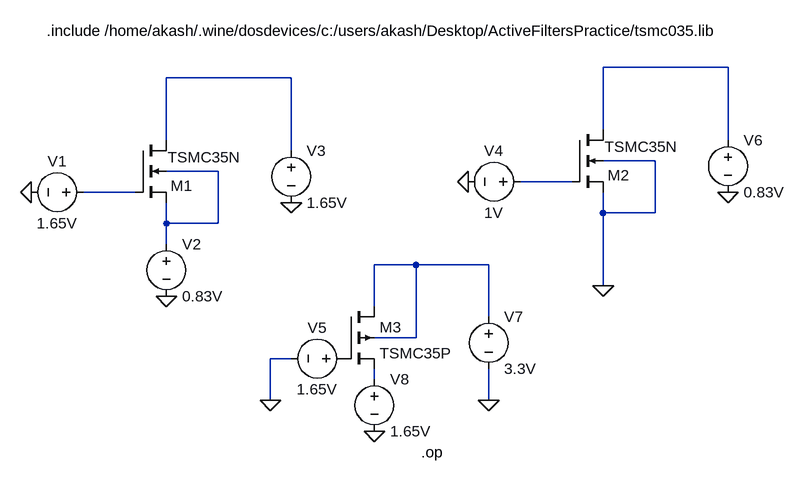
[diagram p0: schematic Transconductor_Bias_Width_Calculation.asc]
Transconductor_Bias_Width_Calculation.asc, the LTspice schematic file:
Version 4
SHEET 1 880 688
WIRE 736 80 544 80
WIRE 64 96 -128 96
WIRE 544 176 544 80
WIRE -128 192 -128 96
WIRE 736 192 736 80
WIRE 64 208 64 96
WIRE 624 224 544 224
WIRE -48 240 -128 240
WIRE 496 256 416 256
WIRE -176 272 -256 272
WIRE 544 304 544 272
WIRE 624 304 624 224
WIRE 624 304 544 304
WIRE -128 320 -128 288
WIRE -48 320 -48 240
WIRE -48 320 -128 320
WIRE -128 352 -128 320
WIRE 256 384 192 384
WIRE 368 384 256 384
WIRE 544 416 544 304
WIRE 192 448 192 384
WIRE 368 464 368 384
WIRE 256 496 256 384
WIRE 256 496 192 496
WIRE 64 528 32 528
WIRE 192 560 192 544
WIRE 32 592 32 528
WIRE 368 592 368 544
FLAG -336 272 0
FLAG -128 432 0
FLAG 64 288 0
FLAG 336 256 0
FLAG 544 416 0
FLAG 736 272 0
FLAG 368 592 0
FLAG 32 592 0
FLAG 192 640 0
SYMBOL nmos4 -176 192 R0
WINDOW 0 55 70 Left 2
WINDOW 3 50 26 Left 2
SYMATTR InstName M1
SYMATTR Value TSMC35N
SYMATTR Value2 l=0.5u w=105u
SYMBOL voltage -240 272 R90
WINDOW 0 -32 56 VBottom 2
WINDOW 3 32 56 VTop 2
WINDOW 123 0 0 Left 0
WINDOW 39 0 0 Left 0
SYMATTR InstName V1
SYMATTR Value 1.65V
SYMBOL voltage -128 336 R0
WINDOW 123 0 0 Left 0
WINDOW 39 0 0 Left 0
SYMATTR InstName V2
SYMATTR Value 0.83V
SYMBOL voltage 64 192 R0
WINDOW 123 0 0 Left 0
WINDOW 39 0 0 Left 0
SYMATTR InstName V3
SYMATTR Value 1.65V
SYMBOL nmos4 496 176 R0
WINDOW 0 55 70 Left 2
WINDOW 3 50 26 Left 2
SYMATTR InstName M2
SYMATTR Value TSMC35N
SYMATTR Value2 l=0.5u w=12u
SYMBOL voltage 432 256 R90
WINDOW 0 -32 56 VBottom 2
WINDOW 3 32 56 VTop 2
WINDOW 123 0 0 Left 0
WINDOW 39 0 0 Left 0
SYMATTR InstName V4
SYMATTR Value 1V
SYMBOL voltage 736 176 R0
WINDOW 123 0 0 Left 0
WINDOW 39 0 0 Left 0
SYMATTR InstName V6
SYMATTR Value 0.83V
SYMBOL pmos4 144 448 R0
SYMATTR InstName M3
SYMATTR Value TSMC35P
SYMATTR Value2 l=0.5u w=6.8u
SYMBOL voltage 160 528 R90
WINDOW 0 -32 56 VBottom 2
WINDOW 3 32 56 VTop 2
WINDOW 123 0 0 Left 0
WINDOW 39 0 0 Left 0
SYMATTR InstName V5
SYMATTR Value 1.65V
SYMBOL voltage 368 448 R0
WINDOW 123 0 0 Left 0
WINDOW 39 0 0 Left 0
SYMATTR InstName V7
SYMATTR Value 3.3V
SYMBOL voltage 192 544 R0
SYMATTR InstName V8
SYMATTR Value 1.65V
TEXT -312 24 Left 2 !.include /home/akash/.wine/dosdevices/c:/users/akash/Desktop/ActiveFiltersPractice/tsmc035.lib
TEXT 264 672 Left 2 !.op

The netlist it stands for:
* Transconductor_Bias_Width_Calculation.asc
M1 N002 N005 N003 N003 TSMC35N l=0.5u w=105u
V1 N005 0 1.65V
V2 N003 0 0.83V
V3 N002 0 1.65V
M2 N001 N004 0 0 TSMC35N l=0.5u w=12u
V4 N004 0 1V
V6 N001 0 0.83V
M3 N006 P001 N007 N006 TSMC35P l=0.5u w=6.8u
V5 P001 0 1.65V
V7 N006 0 3.3V
V8 N007 0 1.65V
.model NMOS NMOS
.model PMOS PMOS
.lib standard.mos
.include /home/akash/.wine/dosdevices/c:/users/akash/Desktop/ActiveFiltersPractice/tsmc035.lib
.op
.backanno
.end